# Altium schematic sheet Sheet1.SchDoc
size A4
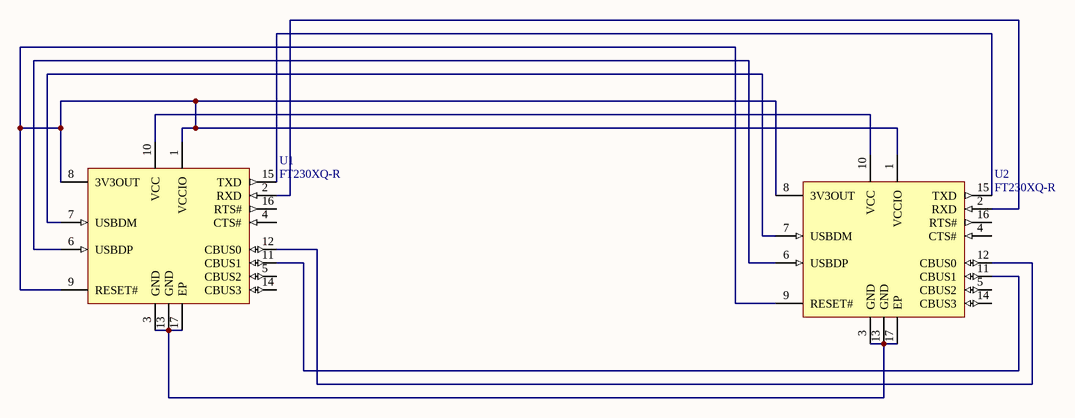
[diagram p0: Sheet1.SchDoc]

## Parts
U1  FT230XQ-R  [QFN-16]
U2  FT230XQ-R  [QFN-16]

## Nets
NetU1_1: U1.1(VCCIO) U1.8(3V3OUT) U1.9(RESET#) U2.1(VCCIO) U2.8(3V3OUT) U2.9(RESET#)
NetU1_2: U1.2(RXD) U2.2(RXD)
NetU1_3: U1.3(GND) U1.13(GND) U1.17(EP) U2.3(GND) U2.13(GND) U2.17(EP)
NetU1_6: U1.6(USBDP) U2.6(USBDP)
NetU1_7: U1.7(USBDM) U2.7(USBDM)
NetU1_10: U1.10(VCC) U2.10(VCC)
NetU1_11: U1.11(CBUS1) U2.11(CBUS1)
NetU1_12: U1.12(CBUS0) U2.12(CBUS0)
NetU1_15: U1.15(TXD) U2.15(TXD)

Not connected (* = marked no-connect by the designer): U1 4(CTS#) 5(CBUS2) 14(CBUS3) 16(RTS#); U2 4(CTS#) 5(CBUS2) 14(CBUS3) 16(RTS#)

## Library data of the parts
U1 U2 = FT230XQ-R: USB to Basic UART Interface Chip, UHCI/OHCI/EHCI Compatible, USB 2.0 Compatible, -40 to +85 degC, 16-Pin QFN, Pb-Free, Tape and Reel; Manufacturer: FTDI; Data Rate: 480 Mb/s, 12 Mb/s; Speed: High-Speed; Interface Type: UART, USB; Operating Supply Current: 6.5 mA to 8.3 mA; Operating Supply Voltage: 2.97 V to 5.5 V; PackagingOptionsScrubbed: FT230XQT; Supplier 1: Mouser; Manufacturer Part Number: FT230XQ-R; RoHS: RoHS Compliant; Category: USB Interface IC; Stock 1: 69254; Pricing 1: 1=2.04, 25=1.97, 100=1.90, 250=1.71, 500=1.54, 1000=1.46, 2500=1.38, 5000=1.38 (USD); Package / Case: QFN-16; Packaging: Reel; Product: USB Bridge Controllers; Series: FT230; Type: Bridge, USB to UART; Brand: FTDI; Mounting Style: SMD/SMT; Maximum Operating Temperature: + 85 C; Standard: USB 2.0; Standard Pack Qty: 5000; Tradename: X-Chip; RoHS - Mouser: Y; Minimum Order Quantity: 1; Reeling: True; ComponentLink1URL: http://www.mouser.com/ds/2/163/DS_FT230X-5395.pdf; ComponentLink1Description: http://www.mouser.com/ds/2/163/DS_FT230X-5395.pdf; Supplier Part Number 1: 895-FT230XQ-R